# Altium schematic sheet 05 Connectors, LDO, EEPROM.SchDoc: <Project Name>
size A3; ApprovedBy: <Appr.>; Author: <Author>; CompanyName: Infineon Technologies AG; Engineer: <Rel.>; Organization: Infineon Technologies AG; Address1: IFAG DES S PS; Address2: Am Campeon 1-12  -  85579 Neubiberg  -  Germany; Address3: 85579 Neubiberg; Address4: Germany; Revision: <Rev.>; SheetNumber: 5; Release: RC00; PageSetup: Record=PageOptions|CenterHorizontal=True|CenterVertical=True|PrintScale=1.01|XCorrection=1.00|YCorrection=1.00|PrintKind=0|BorderSize=5000000|LeftOffset=0|BottomOffset=0|Orientation=2|PaperLength=1000|PaperWidth=1000|Scale=100|PaperSource=7|PrintQuality=-4|MediaType=1|DitherType=10|PaperKind=A3|PrintScaleMode=1; Doc_ConfidentialStatus: <Doc_ConfidentialStatus>; Doc_Preliminary: <Doc_Preliminary>
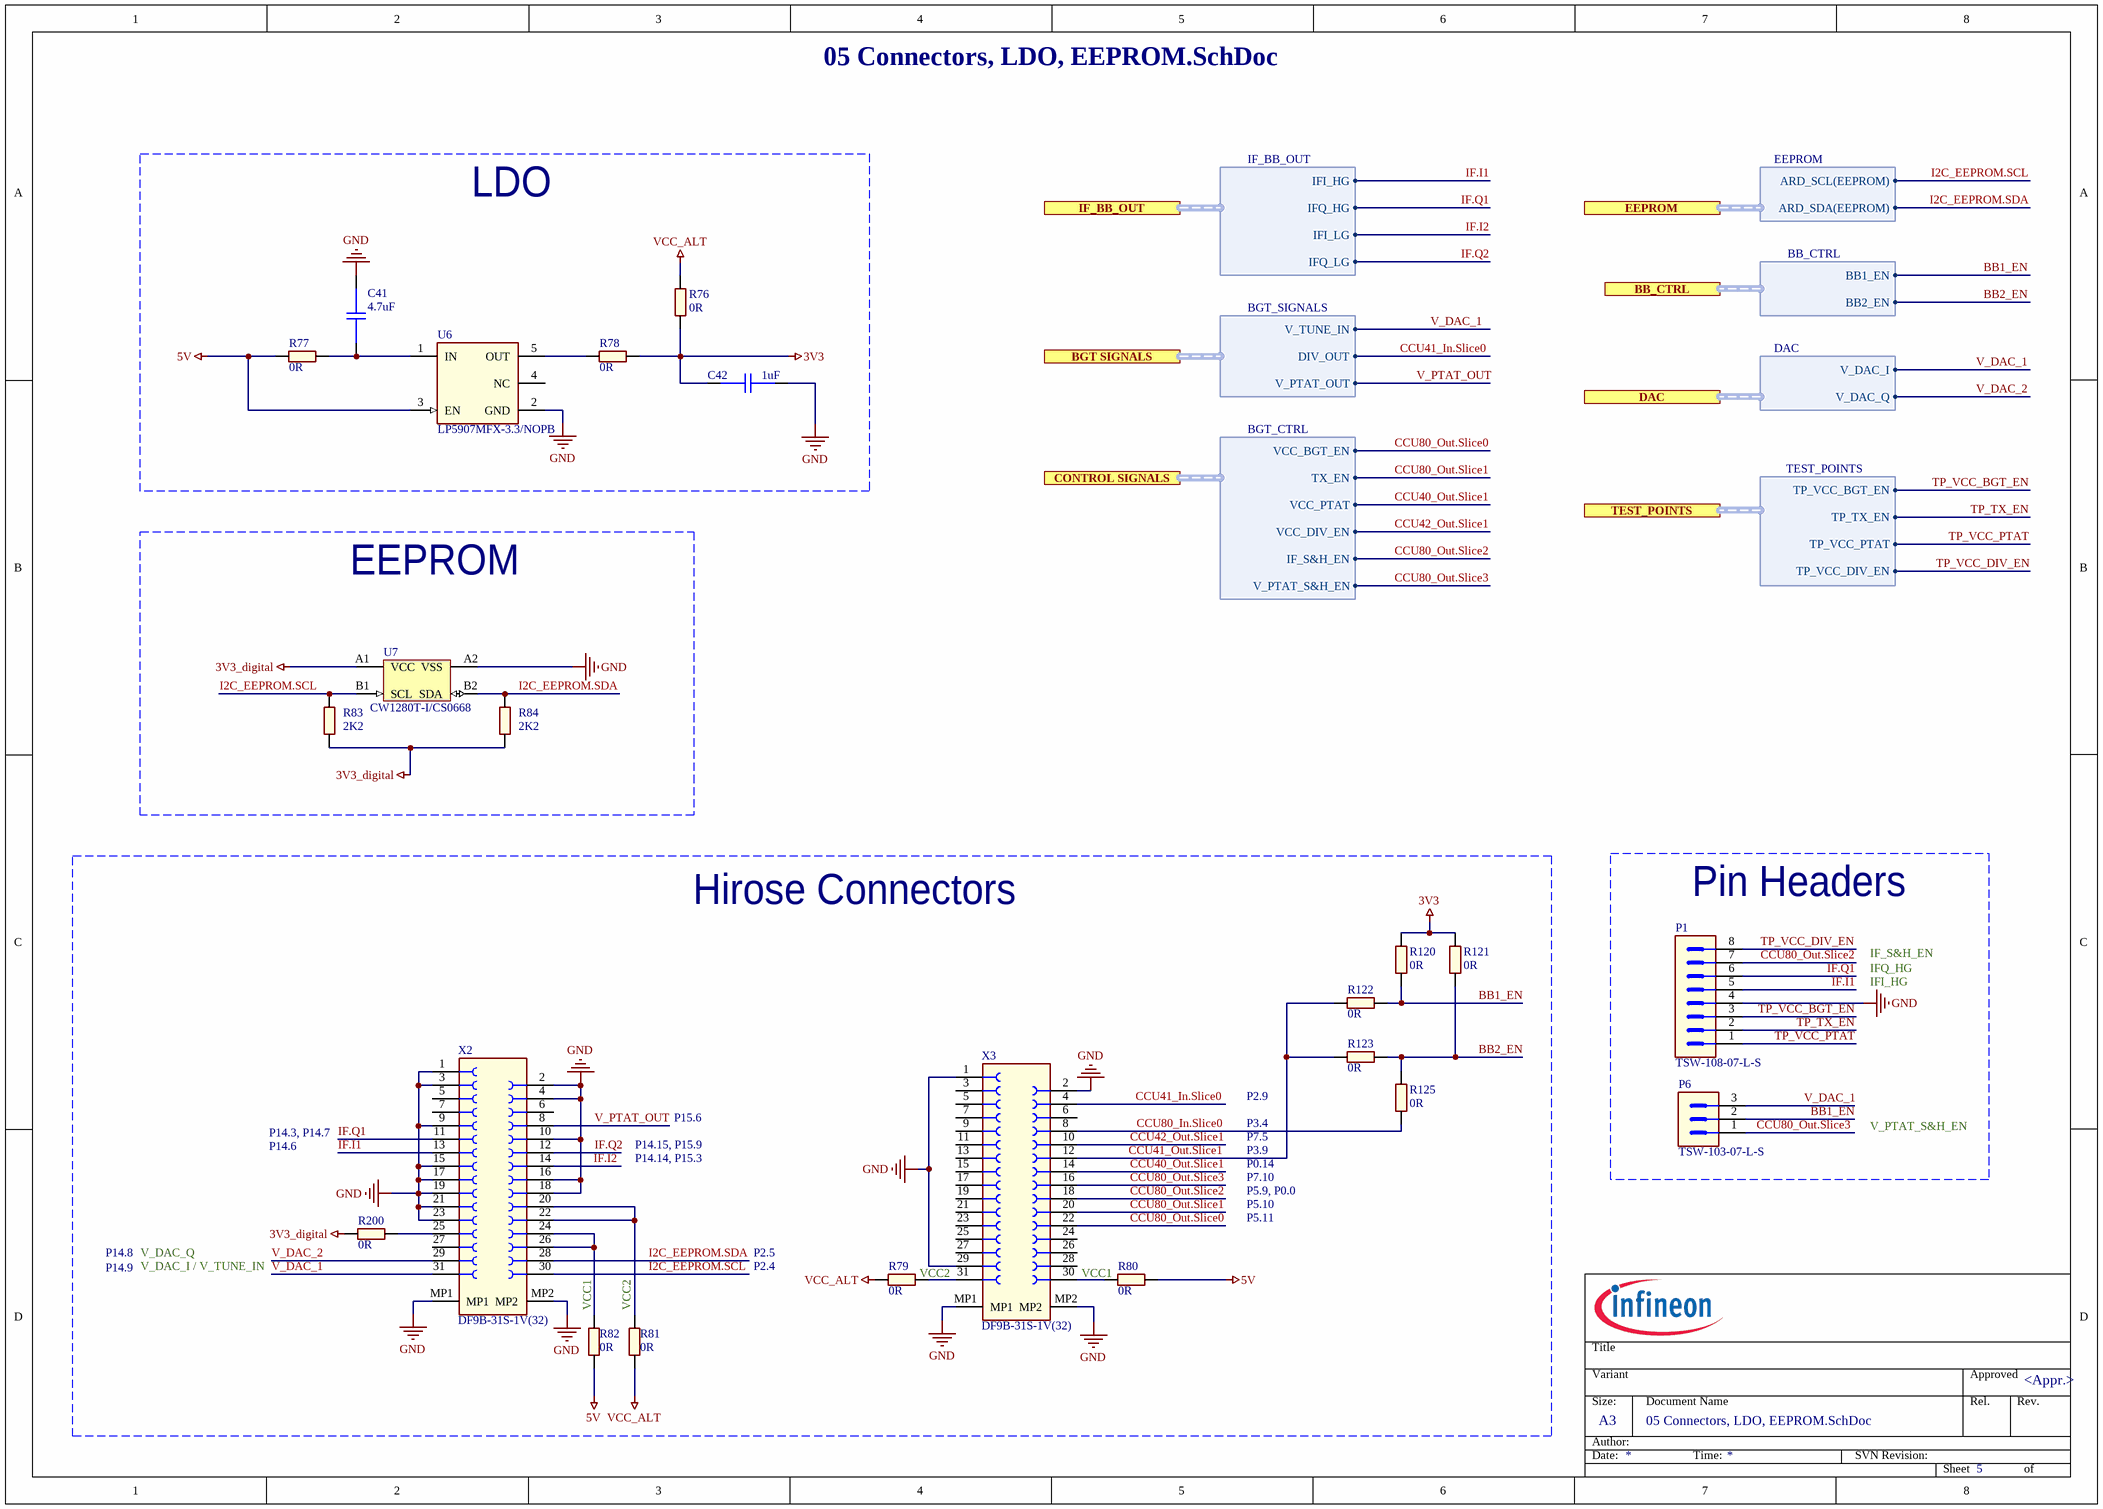
[diagram p0: 05 Connectors, LDO, EEPROM.SchDoc]

## Parts
C41  4.7uF  [CAPC1005X55N-0_2]
C42  1uF  [CAPC1005X55N-0_2]
P1  TSW-108-07-L-S  [CON-M-THT-TSW-108-07-L-S]
P6  TSW-103-07-L-S  [CON-M-THT-TSW-103-07-L-S]
R76  0R  [RESC1005X40N_2]
R77  0R  [RESC1005X40N_2]
R78  0R  [RESC1005X40N_2]
R79  0R  [RESC1005X40N_2]
R80  0R  [RESC1005X40N_2]
R81  0R  [RESC1005X40N_2]
R82  0R  [RESC1005X40N_2]
R83  2K2  [RESC1005X40N_2]
R84  2K2  [RESC1005X40N_2]
R120  0R  [RESC1005X40N_2]
R121  0R  [RESC1005X40N_2]
R122  0R  [RESC1005X40N_2]
R123  0R  [RESC1005X40N_2]
R125  0R  [RESC1005X40N_2]
R200  0R  [RESC1005X40N_2]
U6  LP5907MFX-3.3/NOPB  [SOT95P280X145-5N-2]
U7  CW1280T-I/CS0668  [WLCSP4 (CS0)]
X2  DF9B-31S-1V(32)  [CON-F-SMD-DF9B-31S-1V-32-1]
X3  DF9B-31S-1V(32)  [CON-F-SMD-DF9B-31S-1V-32-1]

## Ports
BB_CTRL (harness BB_CTRL), BGT SIGNALS (harness BGT_SIGNALS), CONTROL SIGNALS (harness BGT_CTRL), DAC (harness DAC), EEPROM (harness EEPROM), IF_BB_OUT (harness IF_BB_OUT), TEST_POINTS (harness TEST_POINTS)

## Harnesses
BGT_CTRL: VCC_BGT_EN, TX_EN, VCC_PTAT, VCC_DIV_EN, IF_S&H_EN, V_PTAT_S&H_EN
EEPROM: ARD_SCL(EEPROM), ARD_SDA(EEPROM)
TEST_POINTS: TP_VCC_BGT_EN, TP_TX_EN, TP_VCC_PTAT, TP_VCC_DIV_EN
DAC: V_DAC_I, V_DAC_Q
BGT_SIGNALS: V_TUNE_IN, DIV_OUT, V_PTAT_OUT
IF_BB_OUT: IFI_HG, IFQ_HG, IFQ_LG, IFI_LG
BB_CTRL: BB1_EN, BB2_EN

## Nets
3V3: C42.2 R76.2 R78.1 R120.1 R121.1
3V3_digital: R83.2 R84.2 R200.2 U7.A1(VCC)
5V: R77.2 R80.1 R82.1 U6.3(EN)
GND: C41.1 C42.1 P1.4 U6.2(GND) U7.A2(VSS) X2.1 X2.2 X2.3 X2.4 X2.9 X2.10 X2.15 X2.16 X2.17 X2.18 X2.19 X2.21 X2.23 X2.MP1 X2.MP2 X3.1 X3.2 X3.29 X3.MP1 X3.MP2
VCC_ALT: R76.1 R79.1 R81.1
BB1_EN: P6.2 R120.2 R122.1 ; port BB_CTRL.BB1_EN
BB2_EN: R121.2 R123.1 R125.1 ; port BB_CTRL.BB2_EN
CCU40_Out.Slice1: X3.14 ; port CONTROL SIGNALS.VCC_PTAT
CCU41_In.Slice0: X3.4 ; port BGT SIGNALS.DIV_OUT
CCU41_Out.Slice1: R122.2 R123.2 X3.12
CCU42_Out.Slice1: X3.10 ; port CONTROL SIGNALS.VCC_DIV_EN
CCU80_In.Slice0: R125.2 X3.8
CCU80_Out.Slice0: X3.22 ; port CONTROL SIGNALS.VCC_BGT_EN
CCU80_Out.Slice1: X3.20 ; port CONTROL SIGNALS.TX_EN
CCU80_Out.Slice2: P1.7 X3.18 ; port CONTROL SIGNALS.IF_S&H_EN
CCU80_Out.Slice3: P6.1 X3.16 ; port CONTROL SIGNALS.V_PTAT_S&H_EN
I2C_EEPROM.SCL: R83.1 U7.B1(SCL) X2.30 ; port EEPROM.ARD_SCL(EEPROM)
I2C_EEPROM.SDA: R84.1 U7.B2(SDA) X2.28 ; port EEPROM.ARD_SDA(EEPROM)
IF.I1: P1.5 X2.13 ; port IF_BB_OUT.IFI_HG
IF.I2: X2.14 ; port IF_BB_OUT.IFI_LG
IF.Q1: P1.6 X2.11 ; port IF_BB_OUT.IFQ_HG
IF.Q2: X2.12 ; port IF_BB_OUT.IFQ_LG
TP_TX_EN: P1.2 ; port TEST_POINTS.TP_TX_EN
TP_VCC_BGT_EN: P1.3 ; port TEST_POINTS.TP_VCC_BGT_EN
TP_VCC_DIV_EN: P1.8 ; port TEST_POINTS.TP_VCC_DIV_EN
TP_VCC_PTAT: P1.1 ; port TEST_POINTS.TP_VCC_PTAT
V_DAC_1: P6.3 X2.31 ; port DAC.V_DAC_I, port BGT SIGNALS.V_TUNE_IN
V_DAC_2: X2.29 ; port DAC.V_DAC_Q
V_PTAT_OUT: X2.8 ; port BGT SIGNALS.V_PTAT_OUT
NetC41_2: C41.2 R77.1 U6.1(IN)
NetR78_2: R78.2 U6.5(OUT)
NetR79_2: R79.2 X3.31
NetR80_2: R80.2 X3.30
NetR81_2: R81.2 X2.20 X2.22
NetR82_2: R82.2 X2.24 X2.26
NetR200_1: R200.1 X2.25

Not connected (* = marked no-connect by the designer): U6 4(NC); X2 5 6 7 27; X3 3 5 6 7 9 11 13 15 17 19 21 23 24 25 26 27 28

## Notes on the sheet
- LDO
- EEPROM
- Hirose Connectors
- (near P1) Pin Headers
- IFQ_HG
- IFI_HG
- IF_S&H_EN
- P15.6
- P2.9
- P3.4
- P14.3, P14.7
- P14.6
- P14.15, P15.9
- P14.14, P15.3
- P7.5
- P0.14
- P5.9, P0.0
- P7.10
- P3.9
- V_PTAT_S&H_EN
- P14.8
- V_DAC_Q
- P2.5
- P5.10
- P5.11
- P14.9
- V_DAC_I / V_TUNE_IN
- (near R82) VCC1
- (near R81) VCC2
- P2.4
- (near R79) VCC2
- (near R80) VCC1
- Title
- Variant
- Approved
- Date:
- Author:
- Size:
- A3
- Document Name
- Time:
- SVN Revision:
- Rel.
- Rev.
- Sheet
- of

## Library data of the parts
C41 C42 = CAP01010597: General Purpose Surface Mount Ceramic Capacitor; Manufacturer: muRata; PartRelease: new; Manufacturer Component Status: Active; ComponentStatus: Released; Voltage: 50Vdc; Tolerance: 2%; TemperaturCharacteristic: C0G; AutomotiveQualified: no; ColibryArticleNumber: 308039; PartNumber: CAP01010597; PackageReference: 0402; PackageDescription: Capacitor,non-polarized,Chip;1.00mm L X 0.50mm W X 0.55mm H; ComponentHeight: 0.55mm; PartType: General Purpose Surface Mount Ceramic Capacitor; ComponentLink1Description: Vendor WebSite; ComponentLink1URL: http://www.murata.com; ComponentLink2Description: Datasheet; ComponentLink2URL: \\MUCSDN31.eu.infineon.com\PCB_Library_Datasheets\GRM1555C1H101GA01.pdf; FixedSupplier: Yes; PartProvision: No; Supplier 1: Farnell; Supplier 2: Digi-Key; Supplier 3: Mouser
  C41: Value: 4.7uF
  C42: Value: 1uF
P1 = 382934: Through hole .025'' SQ Post Header, 2.54mm pitch, 8 pin, vertical, single row; Legacy PartNumber: CON01500577; Manufacturer: Samtec; Manufacturer Component Status: Active; Symbol type: Header 8 Pins; Article Number: 382934; Version Number: V01; Legacy DeviceID: SAM_TSW-108-07-L-S; Combined Parameters: Board-to-Board Header (male);8x1;Mounting:THT;Orient:0° (vertical);Shielded:No; QuickPick: 0° (vertical) / Board-to-Board; Style: Strip; Automotive Qualified: No; ComponentStatus: Released; Second Source allowed: Yes; Voltage DC (max): na; Part Type: Connector; Manufacturer Order Number: TSW-108-07-L-S; Value: TSW-108-07-L-S; Type: Board-to-Board; Temperature min: -55; Temperature max: 125; Temperature Range: Military; ROHS Compliant: Y; ComponentLink1Description: Vendor WebSite; ComponentLink1URL: http://www.samtec.com/; ComponentLink2Description: Datasheet; ComponentLink2URL: http://webnetprod.muc.infineon.com/PCBPortal_Prod/WorkFlows/AltiumComponent/StandardDocumentation?Versionid=382935; Supplier 1: Farnell; Supplier Part Number 1: 2035610; Supplier 2: DigiKey; Supplier Part Number 2: SAM1031-08-ND; Supplier 3: Mouser; PLMStatus: Active; Package Description: Header,vertical,2.54mm pitch;0.64mm lead width,8 pins,1 row,8 pins per row,20.32mm L X 2.54mm W X 8.636mm H body
P6 = 382914: Through hole .025 SQ Post Header, 2.54mm pitch, 3 pin, vertical, single row; Legacy PartNumber: CON01500575; Manufacturer: Samtec; Article Number: 382914; Version Number: V01; Legacy DeviceID: SAM_TSW-103-07-L-S; Combined Parameters: Board-to-Board Header (male);3x1;Mounting:THT;Orient:0Â° (vertical);Shielded:No; QuickPick: 0Â° (vertical) / Board-to-Board; Style: Strip; Automotive Qualified: No; PLMStatus: Active; Second Source allowed: Yes; Voltage DC (max): na; Part Type: Connector; Manufacturer Order Number: TSW-103-07-L-S; Value: TSW-103-07-L-S; Type: Board-to-Board; Temperature min: -55; Temperature max: 125; Temperature Range: Military; ROHS Compliant: Y; ComponentLink1Description: Vendor WebSite; ComponentLink1URL: http://www.samtec.com/; ComponentLink2Description: Datasheet; ComponentLink2URL: http://webnetprod.muc.infineon.com/PCBPortal_Prod/WorkFlows/AltiumComponent/StandardDocumentation?Versionid=382915; Supplier 1: Farnell; Supplier Part Number 1: 2035606; Supplier 2: DigiKey; Supplier Part Number 2: SAM1031-03-ND; Supplier 3: Mouser; Package Description: Header,vertical,2.54mm pitch;0.64mm lead width,3 pins,1 row,3 pins per row,7.62mm L X 2.54mm W X 8.636mm H body
R76 R78-R82 R120-R123 R125 R200 = RES01800000: 0R/50V/20mOhm; Manufacturer: Vishay; ManufacturerPartNumber: CRCW04020000Z0ED; PartProvision: no; PartRelease: new; Manufacturer Component Status: Active; Symbol Type: Standard Resistor Symbol; Alternate View: yes; ComponentStatus: Released; Power: 1.5A; Voltage: 50V; Tolerance: 20mOhm; AutomotiveQualified: AEC-Q200; ColibryArticleNumber: 339877; PartNumber: RES01800000; PackageReference: 0402; Value: 0R; Type: 0R/50V/20mOhm; PartType: Thick Film Chip Resistor; ComponentHeight: 0.4mm; TK: -; ComponentLink1Description: Vendor WebSite; ComponentLink1URL: http://www.vishay.com/; ComponentLink2Description: Datasheet; ComponentLink2URL: \\MUCSDN31.eu.infineon.com\PCB_Library_Datasheets\dcrcwe3.pdf; FixedSupplier: no
R77 = RES01800000: 0R/50V/20mOhm; Manufacturer: Vishay; PartProvision: no; PartRelease: new; Manufacturer Component Status: Active; Symbol Type: Standard Resistor Symbol; Alternate View: yes; ComponentStatus: Released; Power: 1.5A; Voltage: 50V; Tolerance: 20mOhm; AutomotiveQualified: AEC-Q200; ColibryArticleNumber: 339877; PartNumber: RES01800000; PackageReference: 0402; Value: 0R; Type: 0R/50V/20mOhm; PartType: Thick Film Chip Resistor; ComponentHeight: 0.4mm; TK: -; ComponentLink1Description: Vendor WebSite; ComponentLink1URL: http://www.vishay.com/; ComponentLink2Description: Datasheet; ComponentLink2URL: \\MUCSDN31.eu.infineon.com\PCB_Library_Datasheets\dcrcwe3.pdf; FixedSupplier: no
R83 R84 = RES01800000: 2K2/50V/20mOhm; Manufacturer: Vishay; PartProvision: no; PartRelease: new; Manufacturer Component Status: Active; Symbol Type: Standard Resistor Symbol; Alternate View: yes; ComponentStatus: Released; Power: 1.5A; Voltage: 50V; Tolerance: 20mOhm; AutomotiveQualified: AEC-Q200; ColibryArticleNumber: 339877; PartNumber: RES01800000; PackageReference: 0402; Value: 2K2; Type: 2K2/50V/20mOhm; PartType: Thick Film Chip Resistor; ComponentHeight: 0.4mm; TK: -; ComponentLink1Description: Vendor WebSite; ComponentLink1URL: http://www.vishay.com/; ComponentLink2Description: Datasheet; ComponentLink2URL: \\MUCSDN31.eu.infineon.com\PCB_Library_Datasheets\dcrcwe3.pdf; FixedSupplier: no
U6 = IC02601280: 250mA Ultra-Low-Noise, Low-IQ LDO, 3.3V; Multiple Parts: No; Manufacturer: Texas Instruments; PartRelease: new; Manufacturer Component Status: Active; ComponentStatus: Released; ColibryArticleNumber: 465422; Symbol Type: 250mA Ultra-Low-Noise, Low-IQ LDO; Alternate View: No; PartNumber: IC02601280; ComponentName: LP5907MFX-3.3/NOPB; Type: LP5907; ComponentHeight: 1.45mm; ManufacturerPartNumber: LP5907MFX-3.3/NOPB; PackageDescription: SOT,0.95mm pitch;5 pin,1.60mm W X 2.90mm L X 1.45mm H body; PackageReference: SOT23-5 (DBV); AutomotiveQualified: no; ComponentLink1Description: Vendor WebSite; ComponentLink1URL: http://www.ti.com/; ComponentLink2Description: Datasheet; ComponentLink2URL: \\MUCSDN31.eu.infineon.com\PCB_Library_Datasheets\lp5907mfx.pdf; FixedSupplier: yes; PartProvision: no; Supplier 1: Farnell; Supplier Part Number 1: 2492304; Supplier 2: Digi-Key; Supplier Part Number 2: 296-38557-2-ND; Supplier 3: Mouser; Supplier Part Number 3: 595-LP5907MFX-3.3NPB; Value: LP5907MFX-3.3/NOPB
U7 = 24CW128X: 128K I2C Serial EEPROM with Software Write Protection in CSP4 Package, 0.4mm Pin Pitch
X2 X3 = 525897: SMT Board-to-Board connectors-standard interface connector; Manufacturer: Hirose Connectors; Manufacturer Component Status: Active; Symbol Type: Socket Vertical, 31 Pins with 2 Metal Fittings; Alternate View: No; Article Number: 525897; Version Number: V01; Legacy DeviceID: HRS_DF9B-31S-1V(32); Combined Parameters: Board-to-Board Socket (female);-x-;Mounting:SMT;Orient:0° (vertical);Shielded:No; QuickPick: 0° (vertical) / Board-to-Board; ComponentStatus: Released; Second Source allowed: Yes; Voltage DC (max): na; Multiple Parts: No; Part Type: Connector; Manufacturer Order Number: DF9B-31S-1V(32); Value: DF9B-31S-1V(32); Type: Board-to-Board; Application: Standard Interface; Temperature min: -45; Temperature max: 125; Temperature Range: Automotive; ROHS Compliant: Y; Automotive Qualified: No; PackageReference: SMT; ComponentLink1Description: Vendor WebSite; ComponentLink1URL: http://www.hirose.com/; ComponentLink2Description: Datasheet; ComponentLink2URL: http://webnetprod.muc.infineon.com/PCBPortal_Prod/WorkFlows/AltiumComponent/StandardDocumentation?Versionid=525898; Supplier 1: Farnell; Supplier Part Number 1: 2300358; Supplier 2: DigiKey; Supplier Part Number 2: H10394CT-ND; Supplier 3: Mouser; Supplier Part Number 3: 798-DF9B-31S-1V32; PLMStatus: Active; Package Description: Connector, SMD; 1.00 mm pitch, 31 pin, 19.30 mm L X 4.20 mm W X 3.50 mm H body; System: Connector